# EAGLE design date-shift-r1 (EAGLE 6.5.0)
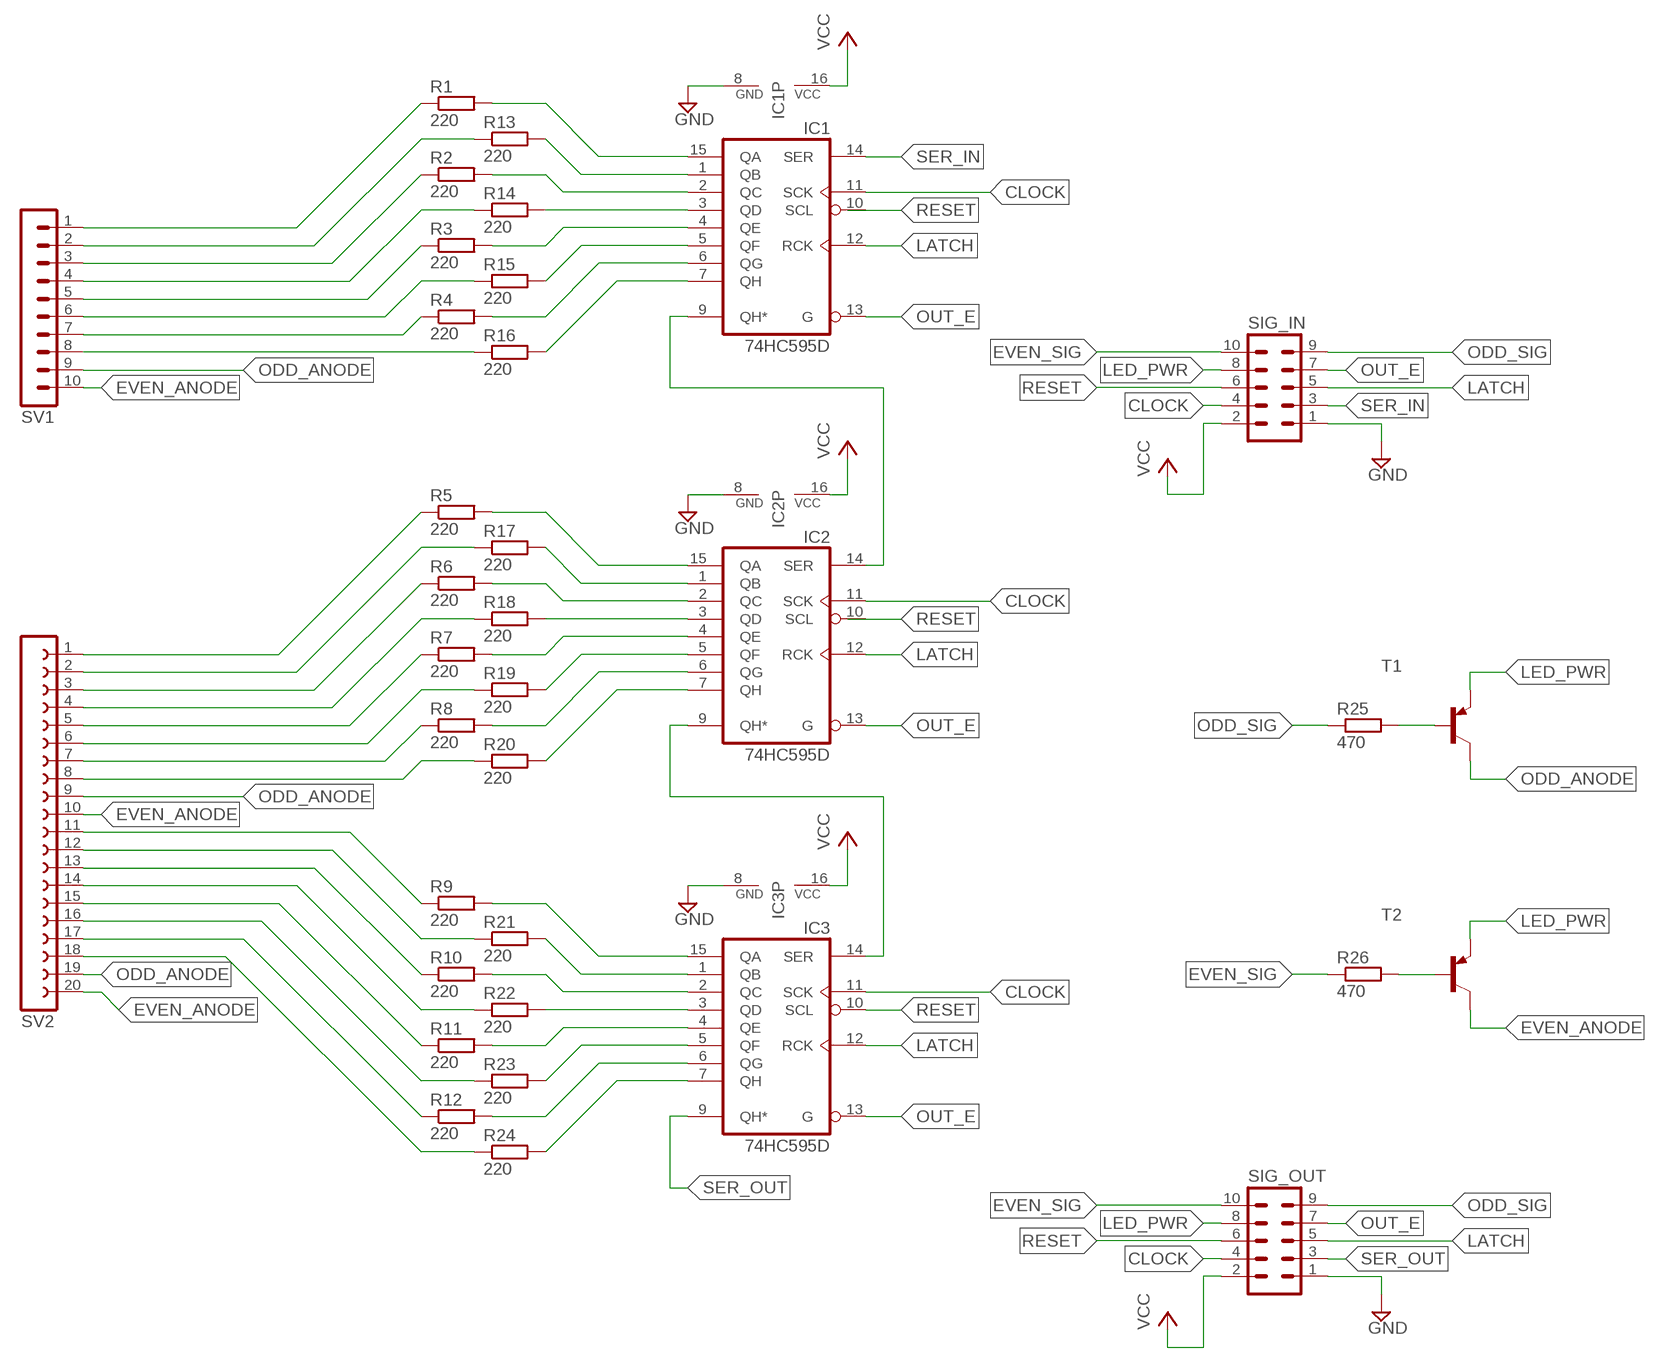
[diagram p0: schematic, sheet 1]

## Parts
IC1  74HC595D  [SO16]
IC2  74HC595D  [SO16]
IC3  74HC595D  [SO16]
R1  220  R-EU_R0805  [R0805]
R2  220  R-EU_R0805  [R0805]
R3  220  R-EU_R0805  [R0805]
R4  220  R-EU_R0805  [R0805]
R5  220  R-EU_R0805  [R0805]
R6  220  R-EU_R0805  [R0805]
R7  220  R-EU_R0805  [R0805]
R8  220  R-EU_R0805  [R0805]
R9  220  R-EU_R0805  [R0805]
R10  220  R-EU_R0805  [R0805]
R11  220  R-EU_R0805  [R0805]
R12  220  R-EU_R0805  [R0805]
R13  220  R-EU_R0805  [R0805]
R14  220  R-EU_R0805  [R0805]
R15  220  R-EU_R0805  [R0805]
R16  220  R-EU_R0805  [R0805]
R17  220  R-EU_R0805  [R0805]
R18  220  R-EU_R0805  [R0805]
R19  220  R-EU_R0805  [R0805]
R20  220  R-EU_R0805  [R0805]
R21  220  R-EU_R0805  [R0805]
R22  220  R-EU_R0805  [R0805]
R23  220  R-EU_R0805  [R0805]
R24  220  R-EU_R0805  [R0805]
R25  470  R-EU_R0805  [R0805]
R26  470  R-EU_R0805  [R0805]
SIG_IN  MA05-2  [MA05-2]
SIG_OUT  MA05-2  [MA05-2]
SV1  MA10-1  [MA10-1]
SV2  FE20-1  [FE20]
T1  BC557B-PNP-TO92-EBC  [TO92-EBC]
T2  BC557B-PNP-TO92-EBC  [TO92-EBC]

## Nets
CLOCK: IC1.11(SCK) IC2.11(SCK) IC3.11(SCK) SIG_IN.4 SIG_OUT.4
EVEN_ANODE: SV1.10 SV2.10 SV2.20 T2.C
EVEN_SIG: R26.1 SIG_IN.10 SIG_OUT.10
GND: IC1.8(GND) IC2.8(GND) IC3.8(GND) SIG_IN.1 SIG_OUT.1
LATCH: IC1.12(RCK) IC2.12(RCK) IC3.12(RCK) SIG_IN.5 SIG_OUT.5
LED_PWR: SIG_IN.8 SIG_OUT.8 T1.E T2.E
N$1: IC2.15(QA) R5.2
N$2: IC2.2(QC) R6.2
N$3: IC2.4(QE) R7.2
N$4: IC2.6(QG) R8.2
N$5: R20.1 SV2.8
N$6: R19.1 SV2.6
N$7: R18.1 SV2.4
N$8: R17.1 SV2.2
N$9: IC2.1(QB) R17.2
N$10: IC2.3(QD) R18.2
N$11: IC2.5(QF) R19.2
N$12: IC2.7(QH) R20.2
N$13: IC3.15(QA) R9.2
N$14: IC3.2(QC) R10.2
N$15: IC3.4(QE) R11.2
N$16: IC3.6(QG) R12.2
N$17: R24.1 SV2.18
N$18: R23.1 SV2.16
N$19: R22.1 SV2.14
N$20: R21.1 SV2.12
N$21: IC3.1(QB) R21.2
N$22: IC3.3(QD) R22.2
N$23: IC3.5(QF) R23.2
N$24: IC3.7(QH) R24.2
N$25: IC2.9(QH*) IC3.14(SER)
N$26: R5.1 SV2.1
N$27: R6.1 SV2.3
N$28: R7.1 SV2.5
N$29: R8.1 SV2.7
N$30: R9.1 SV2.11
N$31: R10.1 SV2.13
N$32: R11.1 SV2.15
N$33: R12.1 SV2.17
N$36: IC1.15(QA) R1.2
N$37: IC1.2(QC) R2.2
N$38: IC1.4(QE) R3.2
N$39: IC1.6(QG) R4.2
N$40: R16.1 SV1.8
N$41: R4.1 SV1.7
N$42: R3.1 SV1.5
N$43: R13.1 SV1.2
N$44: IC1.1(QB) R13.2
N$45: IC1.3(QD) R14.2
N$46: IC1.5(QF) R15.2
N$47: IC1.7(QH) R16.2
N$48: IC1.9(QH*) IC2.14(SER)
N$49: R14.1 SV1.4
N$50: R2.1 SV1.3
N$51: R1.1 SV1.1
N$52: R15.1 SV1.6
N$53: R26.2 T2.B
N$54: R25.2 T1.B
ODD_ANODE: SV1.9 SV2.9 SV2.19 T1.C
ODD_SIG: R25.1 SIG_IN.9 SIG_OUT.9
OUT_E: IC1.13(G) IC2.13(G) IC3.13(G) SIG_IN.7 SIG_OUT.7
RESET: IC3.10(SCL) SIG_IN.6 SIG_OUT.6
SER_IN: IC1.14(SER) SIG_IN.3
SER_OUT: IC3.9(QH*) SIG_OUT.3
VCC: IC1.16(VCC) IC2.16(VCC) IC3.16(VCC) SIG_IN.2 SIG_OUT.2
Unconnected: IC1.10(SCL) IC2.10(SCL)

## Library data of the parts
IC1-IC3 = 74xx-eu:74*595: 8-bit SHIFT REGISTER, output latch
R1-R26 = rcl:R-EU_: RESISTOR, European symbol
SIG_IN SIG_OUT = con-lstb:MA05-2: PIN HEADER; OC_FARNELL: unknown; OC_NEWARK: unknown
SV1 = con-lstb:MA10-1: PIN HEADER; OC_FARNELL: unknown; OC_NEWARK: unknown
SV2 = con-lsta:FE20-1: FEMALE HEADER; OC_FARNELL: unknown; OC_NEWARK: unknown
T1 T2 = transistor:*-PNP-: PNP Transistror

## Board
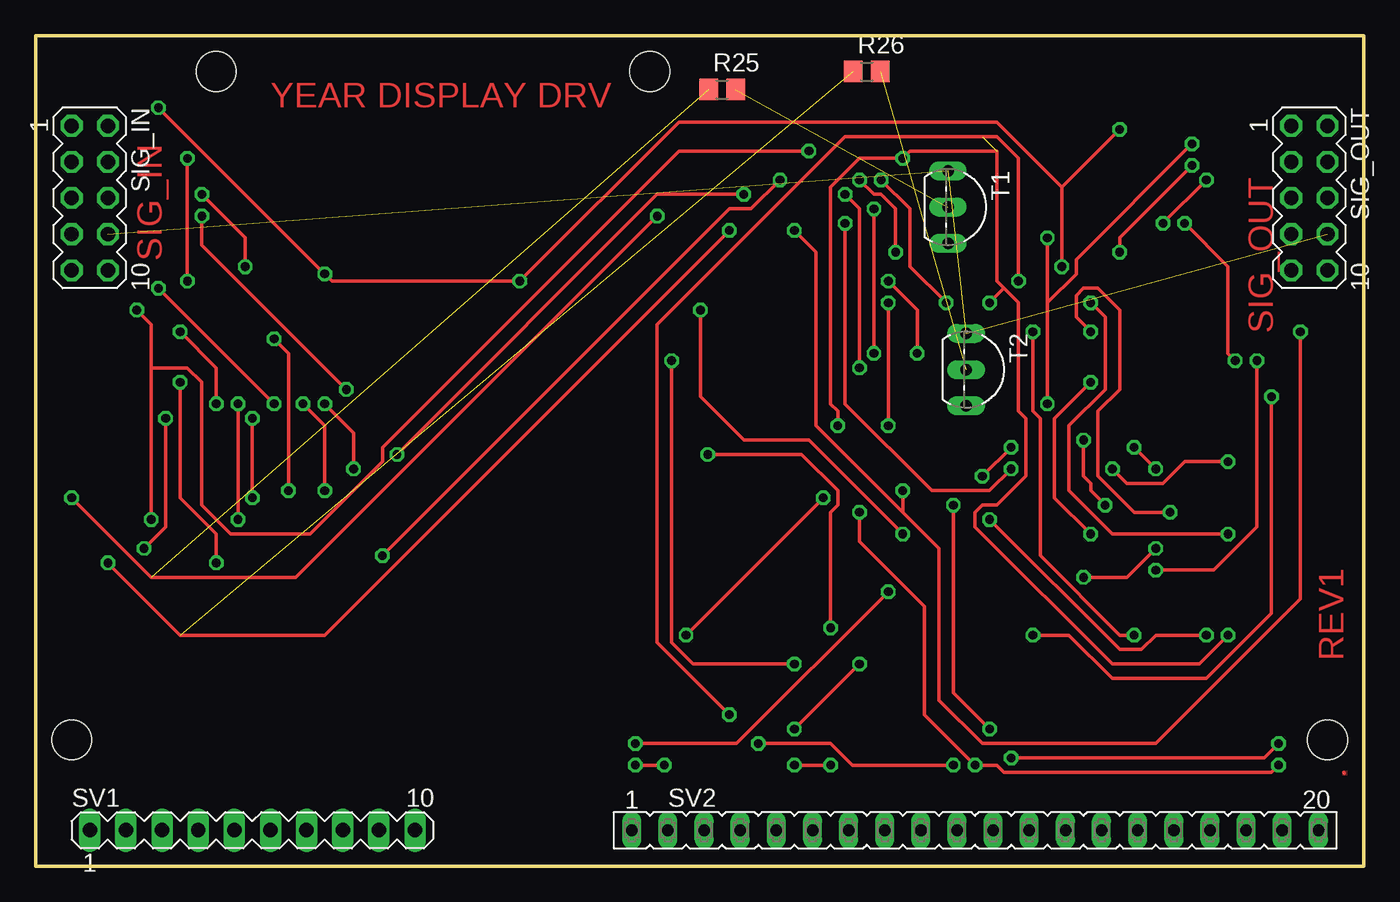
[diagram p1: board, top side]
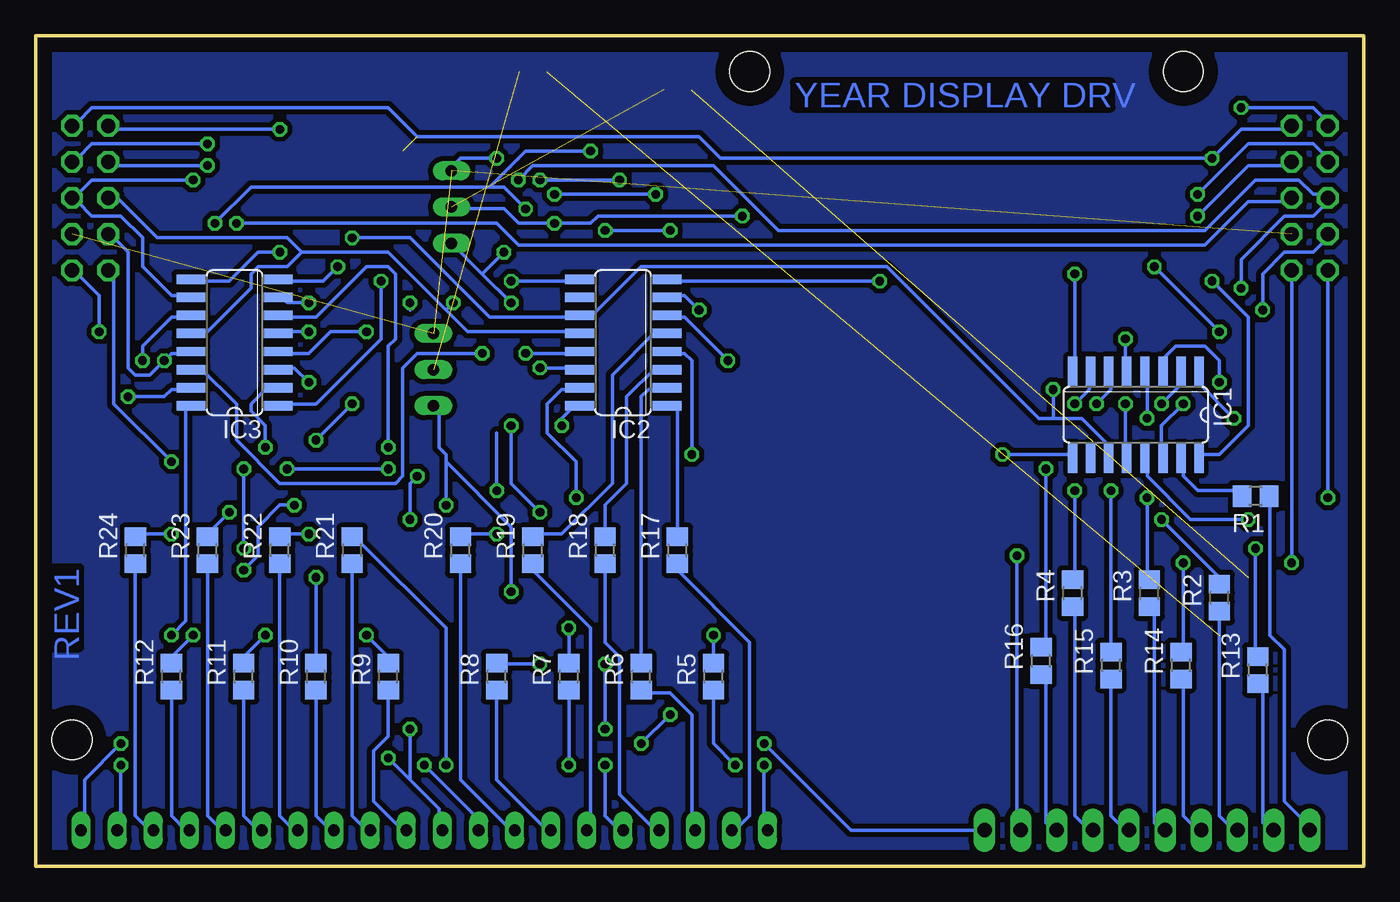
[diagram p2: board, bottom side, seen from below]

Size 93.37 x 58.41 mm. Coordinates in mm from the lower left corner, seen from the top.
Outline: 0,0 93.37,0 93.37,58.41 0,58.41 0,0
Copper layers (1*16): Top 0.035mm / dielectric 1.5mm / Bottom 0.035mm
Design rules "default *": minimum track width 10mil, minimum drill 24mil, track to track 14mil, track to pad 14mil, pad to pad 14mil, via to via 14mil, smd to smd 14mil, copper to edge 40mil, drill to drill 8mil, minimum pad ring 10mil, minimum via ring 8mil, stop-mask expansion 4mil, vias tented up to drill 0mil, thermal gap 10mil
Holes 2.8 mm at 12.7,55.88 43.18,55.88 2.54,8.89 90.81,8.89
tRestrict: area 39.4,1.3 to 92.7,6.3; area 1.3,38.1 to 6.3,58.4; area 87,38.1 to 92.1,58.4; area 49.5,30.5 to 54.6,43.2; area 76.8,30.5 to 81.9,43.2; area 61.6,42.5 to 67.3,50.2; area 62.9,31.1 to 68.6,38.7; area 1.3,1.3 to 29.2,6.3

### Footprints (pad centres in the part's own frame; a part is rotated, then mirrored left to right if it is on the bottom)
SO16 = smd 0.66 x 2.032: 1 -4.445,-3.073; 2 -3.175,-3.073; 3 -1.905,-3.073; 4 -0.635,-3.073; 5 0.635,-3.073; 6 1.905,-3.073; 7 3.175,-3.073; 8 4.445,-3.073; 9 4.445,3.073; 10 3.175,3.073; 11 1.905,3.073; 12 0.635,3.073; 13 -0.635,3.073; 14 -1.905,3.073; 15 -3.175,3.073; 16 -4.445,3.073
R0805 = smd 1.3 x 1.5: 1 -0.95,0; 2 0.95,0
MA05-2 = drill 1.016 octagon: 1 -5.08,-1.27; 2 -5.08,1.27; 3 -2.54,-1.27; 4 -2.54,1.27; 5 0,-1.27; 6 0,1.27; 7 2.54,-1.27; 8 2.54,1.27; 9 5.08,-1.27; 10 5.08,1.27
MA10-1 = drill 1.016 long: 1 -11.43,0; 2 -8.89,0; 3 -6.35,0; 4 -3.81,0; 5 -1.27,0; 6 1.27,0; 7 3.81,0; 8 6.35,0; 9 8.89,0; 10 11.43,0
FE20 = drill 0.813 long: 1 -24.13,0; 2 -21.59,0; 3 -19.05,0; 4 -16.51,0; 5 -13.97,0; 6 -11.43,0; 7 -8.89,0; 8 -6.35,0; 9 -3.81,0; 10 -1.27,0; 11 1.27,0; 12 3.81,0; 13 6.35,0; 14 8.89,0; 15 11.43,0; 16 13.97,0; 17 16.51,0; 18 19.05,0; 19 21.59,0; 20 24.13,0
TO92-EBC = drill 0.813 long: B 0,-1.27; C 2.54,-1.27; E -2.54,-1.27

### Placement (x,y rotation side)
IC1  16.03,31.75 180 bottom
IC2  52.07,36.83 90 bottom
IC3  79.38,36.83 90 bottom
R1  7.62,26.04 180 bottom
R2  10.16,18.89 90 bottom
R3  15.08,19.21 90 bottom
R4  20.48,19.21 90 bottom
R5  45.72,13.34 90 bottom
R6  50.8,13.34 90 bottom
R7  55.88,13.34 90 bottom
R8  60.96,13.34 90 bottom
R9  68.58,13.34 90 bottom
R10  73.66,13.34 90 bottom
R11  78.74,13.34 90 bottom
R12  83.82,13.34 90 bottom
R13  7.46,13.81 90 bottom
R14  12.86,14.13 90 bottom
R15  17.78,14.13 90 bottom
R16  22.7,14.45 90 bottom
R17  48.26,22.23 90 bottom
R18  53.34,22.23 90 bottom
R19  58.42,22.23 90 bottom
R20  63.5,22.23 90 bottom
R21  71.12,22.23 90 bottom
R22  76.2,22.23 90 bottom
R23  81.28,22.23 90 bottom
R24  86.36,22.23 90 bottom
R25  48.26,54.61 0 top
R26  58.42,55.88 0 top
SIG_IN  3.81,46.99 270 top
SIG_OUT  89.53,46.99 270 top
SV1  15.24,2.54 0 top
SV2  66.04,2.54 0 top
T1  65.41,46.35 270 top
T2  66.67,34.92 270 top

### Tracks (layer width: path | path; a pad name or v marks a point on that pad's centre or on a via)
CLOCK  (via drill 0.61)
  Top 0.254: v85.85,35.56 85.85,23.88 82.8,20.83 v78.74,20.83 | v75.18,25.4 74.17,26.42 74.17,26.92 73.66,27.43 v73.66,29.97 | v71.12,44.2 71.12,39.62 | 71.12,39.62 v71.12,32.51 | v11.68,45.72 11.68,43.69 v21.84,33.53 | v81.28,50.8 73.15,42.67 73.15,41.66 71.12,39.62
  Bottom 0.254: 21.84,31.5 22.86,31.5 33.53,42.16 50.8,42.16 54.36,38.61 54.86,38.61 IC2.11 55.37,38.61 61.47,38.61 67.06,44.2 v71.12,44.2 | 21.84,31.5 19.81,31.5 17.78,29.46 17.78,28.96 IC1.11 | v85.85,35.56 85.85,36.58 83.82,38.61 82.8,38.61 IC3.11 | v78.74,20.83 77.72,21.84 77.72,23.88 76.2,25.4 v75.18,25.4 | v71.12,32.51 v73.66,29.97 | v11.68,45.72 8.13,49.28 5.08,49.28 SIG_IN.4 | 21.84,31.5 v21.84,33.53 | v81.28,50.8 89.41,50.8 90.42,49.78 SIG_OUT.4
EVEN_ANODE  (via drill 0.61)
  Top 0.254: v68.58,7.62 86.36,7.62 v87.38,8.64 | v64.52,25.4 64.52,12.19 v67.06,9.65 | v42.16,8.64 49.28,8.64 v59.94,19.3
  Bottom 0.254: v68.58,7.62 67.06,6.1 | 67.06,6.1 65.02,4.06 65.02,2.54 SV2.10 | v87.38,8.64 89.92,6.1 89.92,2.54 SV2.20 | v64.52,25.4 64.52,28.45 | 64.52,28.45 64.52,28.96 65.02,29.46 65.02,32 T2.C | 67.06,6.1 v67.06,9.65 | SV1.10 36.07,2.54 v42.16,8.64 | v59.94,19.3 59.94,23.88 64.52,28.45
EVEN_SIG  (via drill 0.61)  (1 unrouted)
  Top 0.254: 60.96,24.89 v60.96,26.42 | 60.96,24.89 63.5,22.35 63.5,11.68 66.55,8.64 78.74,8.64 88.9,18.8 v88.9,37.59 | v5.08,21.34 10.16,16.26 20.32,16.26 v48.77,44.7 | v53.34,44.7 54.86,43.18 54.86,30.99 60.96,24.89
  Bottom 0.254: v60.96,26.42 60.96,30.48 | v88.9,37.59 88.9,40.13 90.42,41.66 SIG_OUT.10 | v5.08,21.34 SIG_IN.10 | v53.34,44.7 v48.77,44.7
GND  (via drill 0.61)
  Top 0.254: v8.64,53.34 v20.32,41.66 20.83,41.15 v34.04,41.15 45.21,52.32 67.56,52.32 72.14,47.75 | 72.14,47.75 v72.14,42.16 | 72.14,47.75 v76.2,51.82
  Bottom 0.254: 76.71,41.15 IC3.8 76.2,41.15 73.15,41.15 v72.14,42.16 | 49.28,41.15 IC2.8 48.77,41.15 v34.04,41.15 | v20.32,41.66 20.32,35.05 IC1.8 | v8.64,53.34 3.56,53.34 2.54,52.32 SIG_IN.1 | v76.2,51.82 87.88,51.82 SIG_OUT.1
LATCH  (via drill 0.61)
  Top 0.254: v8.64,40.64 v16.76,32.51 | v59.44,48.26 61.47,46.23 61.47,42.16 v64.01,39.62
  Bottom 0.254: v16.76,32.51 16.76,28.96 IC1.12 | v8.64,40.64 8.64,42.67 5.59,45.72 3.56,45.72 2.54,46.74 SIG_IN.5 2.54,47.24 3.56,47.24 4.57,48.26 7.62,48.26 11.18,44.7 41.15,44.7 45.72,49.28 58.42,49.28 v59.44,48.26 | 64.52,39.12 68.58,43.18 74.68,43.18 | 64.52,39.12 62.99,37.59 55.37,37.59 IC2.12 | 74.68,43.18 75.69,44.2 84.84,44.2 87.88,47.24 SIG_OUT.5 | 74.68,43.18 75.69,42.16 77.72,42.16 78.23,41.66 78.23,40.64 81.28,37.59 82.3,37.59 IC3.12 | 64.52,39.12 v64.01,39.62
LED_PWR  (3 unrouted)
N$1  (via drill 0.61)
  Top 0.254: v55.37,25.91 v45.72,16.26
  Bottom 0.254: v45.72,16.26 R5.2 | v55.37,25.91 55.37,28.45 57.4,30.48 57.4,32.51 56.39,33.53 55.37,33.53 IC2.15
N$2
  Bottom 0.254: R6.2 50.8,33.02 50.29,33.53 49.28,33.53 IC2.2
N$3  (via drill 0.61)
  Top 0.254: v55.88,16.76 55.88,24.89 56.39,25.4 56.39,26.42 53.85,28.96 v47.24,28.96
  Bottom 0.254: v55.88,16.76 R7.2 | v47.24,28.96 47.24,35.56 47.75,36.07 48.77,36.07 IC2.4
N$4  (via drill 0.61)
  Top 0.254: v53.34,9.65 v57.91,14.22 | v53.34,14.22 46.23,14.22 44.7,15.75 v44.7,35.56
  Bottom 0.254: v57.91,14.22 60.96,14.22 R8.2 | v53.34,14.22 v53.34,9.65 | v44.7,35.56 47.75,38.61 48.77,38.61 IC2.6
N$5
  Bottom 0.254: R20.1 63.5,6.1 59.94,2.54 SV2.8
N$6
  Bottom 0.254: R19.1 58.42,20.83 54.36,16.76 54.36,2.54 SV2.6
N$7
  Bottom 0.254: R18.1 53.34,15.75 52.32,14.73 52.32,5.08 49.78,2.54 SV2.4
N$8
  Bottom 0.254: R17.1 48.26,20.83 43.18,15.75 43.18,3.56 44.2,2.54 SV2.2
N$9
  Bottom 0.254: R17.2 48.26,32 48.77,32.51 IC2.1
N$10
  Bottom 0.254: R18.2 53.34,25.4 51.82,26.92 51.82,33.02 49.78,35.05 49.28,35.05 IC2.3
N$11
  Bottom 0.254: R19.2 58.42,23.37 56.39,23.37 52.83,26.92 52.83,34.54 49.78,37.59 49.28,37.59 IC2.5
N$12  (via drill 0.61)
  Top 0.254: v60.96,23.37 54.36,29.97 49.78,29.97 46.74,33.02 v46.74,39.12
  Bottom 0.254: v60.96,23.37 63.5,23.37 R20.2 | v46.74,39.12 47.75,40.13 48.77,40.13 IC2.7
N$13  (via drill 0.61)
  Top 0.254: v70.1,16.26 72.64,16.26 75.69,13.21 82.3,13.21 86.87,17.78 v86.87,33.02
  Bottom 0.254: v70.1,16.26 68.58,14.73 R9.2 | v86.87,33.02 84.33,33.02 83.82,33.53 82.8,33.53 IC3.15
N$14  (via drill 0.61)
  Top 0.254: v73.66,20.32 76.71,20.32 v78.74,22.35 | v77.22,29.46 v78.74,27.94
  Bottom 0.254: v73.66,20.32 R10.2 | v78.74,27.94 v78.74,22.35 | v77.22,29.46 77.22,30.99 78.23,32 78.23,32.51 77.22,33.53 76.71,33.53 IC3.2
N$15  (via drill 0.61)
  Top 0.254: v77.22,16.26 76.2,16.26 70.61,21.84 70.61,31.5 70.1,32 v70.1,37.59
  Bottom 0.254: v77.22,16.26 78.74,14.73 R11.2 | v70.1,37.59 72.64,37.59 74.17,36.07 76.2,36.07 IC3.4
N$16  (via drill 0.61)
  Top 0.254: v82.3,16.26 78.74,16.26 77.72,15.24 76.2,15.24 v67.06,24.38 | v68.58,29.46 v66.55,27.43
  Bottom 0.254: v82.3,16.26 83.82,14.73 R12.2 | v67.06,24.38 67.06,26.92 v66.55,27.43 | v68.58,29.46 68.58,36.58 68.07,37.08 68.07,41.66 68.58,42.16 70.1,42.16 73.66,38.61 76.2,38.61 IC3.6
N$17
  Bottom 0.254: R24.1 86.36,3.56 85.34,2.54 SV2.18
N$18
  Bottom 0.254: R23.1 81.28,3.56 80.26,2.54 SV2.16
N$19
  Bottom 0.254: R22.1 76.2,3.56 75.18,2.54 SV2.14
N$20
  Bottom 0.254: R21.1 71.12,3.56 70.1,2.54 SV2.12
N$21  (via drill 0.61)
  Top 0.254: v64.52,7.11 57.4,7.11 55.88,8.64 v50.8,8.64 | v48.77,10.67 43.69,15.75 43.69,38.1 56.9,51.31 67.56,51.31 69.09,49.78 v69.09,41.15
  Bottom 0.254: v64.52,7.11 64.52,16.76 70.61,22.86 71.12,22.86 R21.2 | v48.77,10.67 v50.8,8.64 | v69.09,41.15 69.09,37.08 73.66,32.51 76.2,32.51 IC3.1
N$22  (via drill 0.61)
  Top 0.254: v74.17,23.37 71.63,25.91 71.63,31.5 v74.17,34.04
  Bottom 0.254: v74.17,23.37 76.2,23.37 R22.2 | v74.17,34.04 75.18,35.05 76.2,35.05 IC3.3
N$23  (via drill 0.61)
  Top 0.254: v79.76,24.89 77.22,24.89 74.68,27.43 74.68,32 76.2,33.53 76.2,39.12 74.68,40.64 73.66,40.64 73.15,40.13 73.15,38.61 v74.17,37.59
  Bottom 0.254: v79.76,24.89 81.28,23.37 R23.2 | v74.17,37.59 76.2,37.59 IC3.5
N$24  (via drill 0.61)
  Top 0.254: v83.82,23.37 75.69,23.37 72.64,26.42 72.64,30.99 75.18,33.53 75.18,38.61 v74.17,39.62
  Bottom 0.254: v83.82,23.37 86.36,23.37 R24.2 | v74.17,39.62 75.69,39.62 76.2,40.13 IC3.7
N$25  (via drill 0.61)
  Top 0.254: v61.98,36.07 61.98,39.12 v59.94,41.15
  Bottom 0.254: v61.98,36.07 66.55,36.07 67.56,35.05 67.56,27.43 68.07,26.92 76.2,26.92 79.25,29.97 79.25,32.51 81.79,35.05 82.3,35.05 IC3.14 | v59.94,41.15 55.37,41.15 IC2.9
N$26  (via drill 0.61)
  Top 0.254: v42.16,7.11 v44.2,7.11
  Bottom 0.254: R5.1 45.72,8.64 v44.2,7.11 | v42.16,7.11 42.16,2.54 SV2.1
N$27
  Bottom 0.254: R6.1 50.8,12.19 48.77,12.19 47.24,10.67 47.24,2.54 SV2.3
N$28  (via drill 0.61)
  Top 0.254: v53.34,7.11 v55.88,7.11
  Bottom 0.254: v55.88,7.11 R7.1 | v53.34,7.11 53.34,3.56 52.32,2.54 SV2.5
N$29
  Bottom 0.254: R8.1 60.96,6.1 57.4,2.54 SV2.7
N$30
  Bottom 0.254: R9.1 68.58,9.14 69.6,8.13 69.6,4.57 67.56,2.54 SV2.11
N$31
  Bottom 0.254: R10.1 73.66,3.56 72.64,2.54 SV2.13
N$32
  Bottom 0.254: R11.1 78.74,3.56 77.72,2.54 SV2.15
N$33
  Bottom 0.254: R12.1 83.82,3.56 82.8,2.54 SV2.17
N$34
  pour Bottom: 0,58.42 93.34,58.42 93.34,-0.64 0,-0.64
N$35
  Top 0.254: 91.95,6.6 92,6.55
  pour Top: 0,58.42 93.34,58.42 93.34,0 0,0
N$36
  Bottom 0.254: R1.2 8.64,26.42 11.68,26.42 12.7,27.43 12.7,28.45 IC1.15
N$37  (via drill 0.61)
  Top 0.254: v14.22,32.51 v14.22,24.38
  Bottom 0.254: v14.22,24.38 10.16,20.32 R2.2 | v14.22,32.51 12.7,34.04 12.7,34.54 IC1.2
N$38  (via drill 0.61)
  Top 0.254: v15.24,31.5 v15.24,25.91
  Bottom 0.254: v15.24,25.91 15.24,20.32 R3.2 | v15.24,31.5 15.24,34.54 IC1.4
N$39  (via drill 0.61)
  Top 0.254: v20.32,26.42 20.32,30.99 v18.8,32.51
  Bottom 0.254: v20.32,26.42 20.32,20.32 R4.2 | v18.8,32.51 17.78,33.53 17.78,34.54 IC1.6
N$40
  Bottom 0.254: R16.1 22.35,13.21 22.35,3.05 21.84,2.54 SV1.8
N$41
  Bottom 0.254: R4.1 20.32,17.78 20.32,3.56 19.3,2.54 SV1.7
N$42
  Bottom 0.254: R3.1 14.73,17.78 14.73,3.05 14.22,2.54 SV1.5
N$43
  Bottom 0.254: R13.1 7.11,12.7 7.11,3.05 6.6,2.54 SV1.2
N$44  (via drill 0.61)
  Top 0.254: v7.62,22.35 9.14,23.88 v9.14,31.5
  Bottom 0.254: v7.62,22.35 7.62,15.24 R13.2 | v9.14,31.5 11.68,34.04 11.68,34.54 IC1.1
N$45  (via drill 0.61)
  Top 0.254: v12.7,21.34 12.7,23.37 10.16,25.91 v10.16,34.04
  Bottom 0.254: v12.7,21.34 12.7,15.24 R14.2 | v10.16,34.04 10.16,35.56 11.18,36.58 13.21,36.58 14.22,35.56 14.22,35.05 IC1.3
N$46  (via drill 0.61)
  Top 0.254: v17.78,26.42 17.78,36.07 v16.76,37.08
  Bottom 0.254: v17.78,26.42 R15.2 | v16.76,37.08 16.76,35.05 IC1.5
N$47  (via drill 0.61)
  Top 0.254: v22.35,27.94 22.35,30.48 v20.32,32.51
  Bottom 0.254: v22.35,27.94 22.35,15.75 R16.2 | v20.32,32.51 19.3,33.53 19.3,34.54 IC1.7
N$48  (via drill 0.61)
  Top 0.254: v25.4,28.96 43.69,47.24 v49.78,47.24 | v56.9,47.24 57.91,46.23 v57.91,35.05
  Bottom 0.254: v25.4,28.96 20.32,28.96 IC1.9 | v56.9,47.24 v49.78,47.24 | v57.91,35.05 55.37,35.05 IC2.14
N$49
  Bottom 0.254: R14.1 12.7,12.7 12.7,3.56 11.68,2.54 SV1.4
N$50
  Bottom 0.254: R2.1 10.16,3.56 9.14,2.54 SV1.3
N$51
  Bottom 0.254: R1.1 6.6,25.91 6.6,16.26 5.59,15.24 5.59,4.57 3.56,2.54 SV1.1
N$52
  Bottom 0.254: R15.1 17.78,3.56 16.76,2.54 SV1.6
N$53  (1 unrouted)
N$54  (1 unrouted)
ODD_ANODE  (via drill 0.61)
  Top 0.254: v87.38,7.11 86.87,6.6 68.07,6.6 67.56,7.11 v66.04,7.11 62.48,10.67 62.48,18.29 57.91,22.86 v57.91,24.89 | v59.94,30.99 v59.94,39.62 | v24.38,21.84 48.77,46.23 50.29,46.23 v52.32,48.26 | v57.91,48.26 58.93,47.24 59.44,47.24 60.45,46.23 v60.45,43.18
  Bottom 0.254: v66.04,7.11 62.48,3.56 62.48,2.54 SV2.9 | v87.38,7.11 87.38,2.54 SV2.19 | v59.94,39.62 61.98,41.66 | 61.98,41.66 T1.C | v59.94,30.99 59.94,26.92 v57.91,24.89 | v24.38,21.84 24.38,2.54 SV1.9 | v57.91,48.26 v52.32,48.26 | 61.98,41.66 v60.45,43.18
ODD_SIG  (via drill 0.61)  (1 unrouted)
  Top 0.254: v43.69,45.72 18.29,20.32 8.13,20.32 v2.54,25.91 | v83.82,28.45 80.77,28.45 79.25,26.92 76.71,26.92 v75.69,27.94 | v68.58,27.94 67.06,26.42 62.99,26.42 56.9,32.51 v56.9,45.21
  Bottom 0.254: 64.01,46.23 60.45,46.23 59.44,45.21 v56.9,45.21 54.36,45.21 53.85,45.72 v43.69,45.72 | SIG_IN.9 v2.54,25.91 | v83.82,28.45 87.88,32.51 87.88,41.66 SIG_OUT.9 | v68.58,27.94 v75.69,27.94
OUT_E  (via drill 0.61)
  Top 0.254: 8.13,35.05 8.13,38.1 v7.11,39.12 | 8.13,35.05 v8.13,24.38 | v58.93,46.23 v58.93,36.07 | v80.77,45.21 83.82,42.16 83.82,36.07 v84.33,35.56 | 8.13,35.05 10.67,35.05 11.68,34.04 11.68,25.4 13.72,23.37 19.3,23.37 24.38,28.45 24.38,29.46 45.21,50.29 v54.36,50.29
  Bottom 0.254: v8.13,24.38 12.19,24.38 15.24,27.43 15.24,28.45 IC1.13 | v7.11,39.12 7.11,41.66 5.59,43.18 3.56,43.18 2.54,44.2 SIG_IN.7 | v58.93,36.07 55.37,36.07 IC2.13 | v58.93,46.23 60.45,47.75 61.47,47.75 | 61.47,47.75 78.23,47.75 v80.77,45.21 | IC3.13 82.8,36.07 83.82,36.07 v84.33,35.56 85.34,34.54 86.36,34.54 86.87,35.05 86.87,43.18 87.88,44.2 SIG_OUT.7 | v54.36,50.29 58.93,50.29 61.47,47.75
RESET  (via drill 0.61)
  Top 0.254: v82.3,48.26 v79.25,45.21
  Bottom 0.254: IC3.10 82.8,40.13 83.82,40.13 85.85,42.16 85.85,44.2 87.38,45.72 89.41,45.72 90.42,46.74 SIG_OUT.6 90.42,47.24 89.41,48.26 v82.3,48.26 | v79.25,45.21 60.96,45.21 59.44,43.69 11.18,43.69 8.13,46.74 5.08,46.74 SIG_IN.6
SER_IN  (via drill 0.61)
  Top 0.254: v12.7,32.51 12.7,35.05 v10.16,37.59 | v14.73,42.16 14.73,44.2 v11.68,47.24
  Bottom 0.254: v12.7,32.51 14.22,30.99 14.22,28.96 IC1.14 | v14.73,42.16 v10.16,37.59 | v11.68,47.24 8.13,50.8 3.56,50.8 2.54,49.78 SIG_IN.3
SER_OUT  (via drill 0.61)
  Top 0.254: v76.2,43.18 76.2,44.2 v81.28,49.28
  Bottom 0.254: v76.2,43.18 77.72,43.18 79.76,41.15 82.3,41.15 IC3.9 | v81.28,49.28 87.88,49.28 SIG_OUT.3
VCC  (via drill 0.61)  (1 unrouted)
  Top 0.254: v10.67,49.78 v10.67,41.15 | v56.39,30.99 56.39,32 55.88,32.51 55.88,47.75 57.91,49.78 v60.96,49.78 61.47,50.29 67.56,50.29 67.56,41.15 68.07,40.64 | v83.82,16.26 81.79,14.22 75.69,14.22 66.04,23.88 66.04,24.89 66.55,25.4 67.56,25.4 69.6,27.43 69.6,31.5 69.09,32 69.09,39.62 68.07,40.64 | 68.07,40.64 v67.06,39.62
  Bottom 0.254: v10.67,41.15 8.13,38.61 8.13,30.99 10.16,28.96 11.68,28.96 IC1.16 | SIG_IN.2 5.08,51.82 8.64,51.82 v10.67,49.78 45.21,49.78 46.74,51.31 66.55,51.31 68.58,53.34 89.41,53.34 90.42,52.32 SIG_OUT.2 | v56.39,30.99 56.39,31.5 55.37,32.51 IC2.16 | v60.96,49.78 63.5,49.78 64.01,49.28 | v83.82,16.26 82.8,17.27 82.8,32.51 IC3.16 | v67.06,39.62 67.06,39.12

### Text on the board
Top: YEAR DISPLAY DRV | SIG_IN | SIG_OUT | REV1
Bottom: YEAR DISPLAY DRV | REV1